# Altium project Snap21.PrjPCB
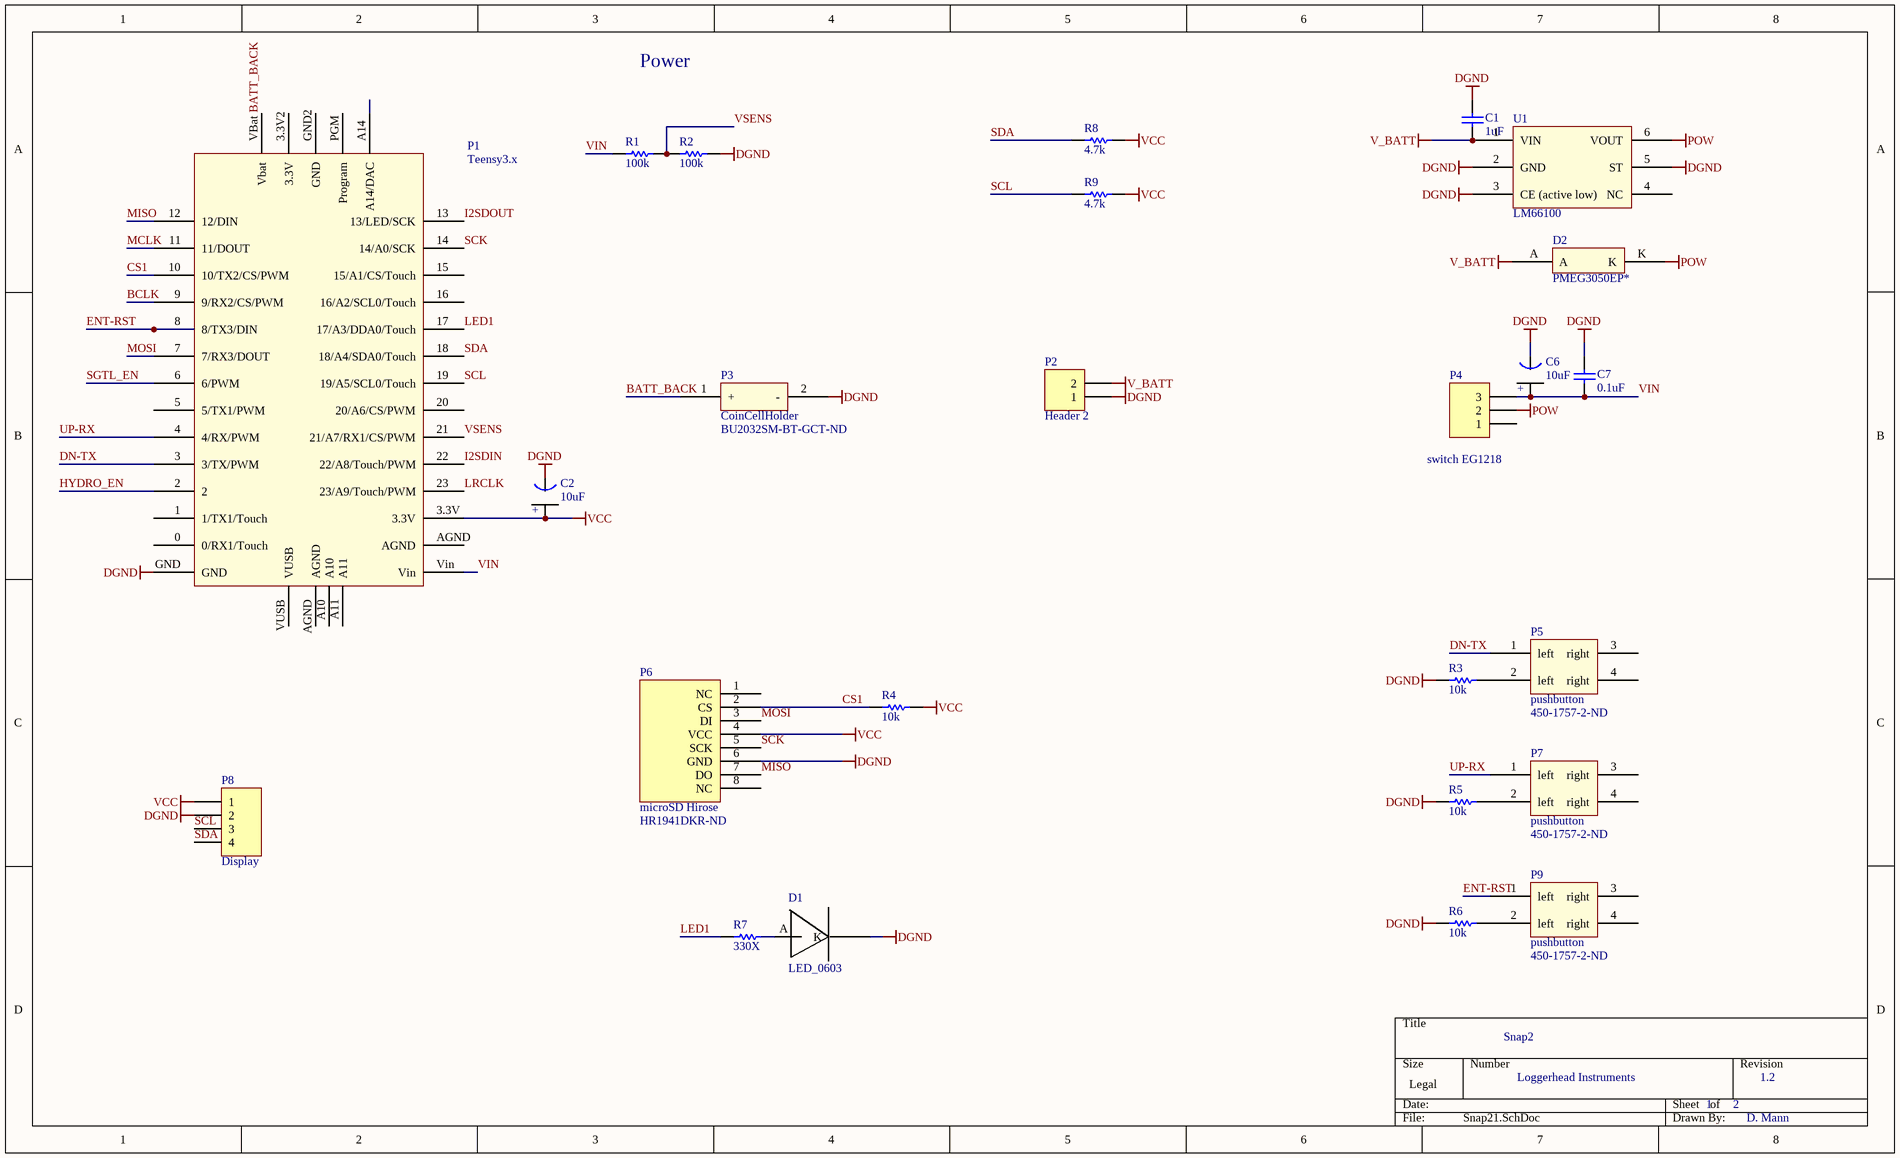
[diagram p0: Snap21.SchDoc]
1 sheet, 25 parts. Net scope: global (net labels, ports and power ports of the same name join across sheets).
Board file: Snap21.PcbDoc

## Sheet Snap21.SchDoc
size Legal

### Parts
C1  1uF  [0402]
C2  10uF  [Tant0805]
C6  10uF  [Tant0805]
C7  0.1uF  [0402]
D1  LED_0603  [Diode0603]
D2  PMEG3050EP*  [Diode_PMEG3050EP]
P1  Teensy3.x  [Teensy3.x]
P2  Header 2  [HDR1X2]
P3  CoinCellHolder  Supplier Part Number 1: BU2032SM-BT-GCT-ND  [CoinCellHolder]
P4  switch EG1218  [HDR1X3]
P5  pushbutton  Supplier Part Number 1: 450-1757-2-ND  [SOP4]
P6  microSD Hirose  Supplier Part Number 1: HR1941DKR-ND  [DM3D microSD]
P7  pushbutton  Supplier Part Number 1: 450-1757-2-ND  [SOP4]
P8  Display  [HDR1X4]
P9  pushbutton  Supplier Part Number 1: 450-1757-2-ND  [SOP4]
R1  100k  [3-0603]
R2  100k  [3-0603]
R3  10k  [3-0603]
R4  10k  [3-0603]
R5  10k  [3-0603]
R6  10k  [3-0603]
R7  330X  [3-0603]
R8  4.7k  [3-0603]
R9  4.7k  [3-0603]
U1  LM66100  [SC-70-6]

### Nets
DGND: C1.1 C2.1(GND) C6.1(GND) C7.2 D1.K P1.GND P2.1 P3.2(-) P6.6(GND) P8.2 R2.1 R3.2 R5.2 R6.2 U1.2(GND) U1.3(CE_(active_low)) U1.5(ST)
POW: D2.K P4.2 U1.6(VOUT)
V_BATT: C1.2 D2.A P2.2 U1.1(VIN)
VCC: C2.2(+) P1.3.3V P6.4(VCC) P8.1 R4.1 R8.2 R9.2
BATT_BACK: P1.VBat(Vbat) P3.1(+)
BCLK: P1.9(9/RX2/CS/PWM)
CS1: P1.10(10/TX2/CS/PWM) P6.2(CS) R4.2
DN-TX: P1.3(3/TX/PWM) P5.1(left)
ENT-RST: P1.8(8/TX3/DIN) P9.1(left)
HYDRO_EN: P1.2
I2SDIN: P1.22(22/A8/Touch/PWM)
I2SDOUT: P1.13(13/LED/SCK)
LED1: P1.17(17/A3/DDA0/Touch) R7.1
LRCLK: P1.23(23/A9/Touch/PWM)
MCLK: P1.11(11/DOUT)
MISO: P1.12(12/DIN) P6.7(DO)
MOSI: P1.7(7/RX3/DOUT) P6.3(DI)
SCK: P1.14(14/A0/SCK) P6.5(SCK)
SCL: P1.19(19/A5/SCL0/Touch) P8.3 R9.1
SDA: P1.18(18/A4/SDA0/Touch) P8.4 R8.1
SGTL_EN: P1.6(6/PWM)
UP-RX: P1.4(4/RX/PWM) P7.1(left)
VIN: C6.2(+) C7.1 P1.Vin P4.3 R1.2
VSENS: P1.21(21/A7/RX1/CS/PWM) R1.1 R2.2
NetD1_A: D1.A R7.2
NetP5_2: P5.2(left) R3.1
NetP7_2: P7.2(left) R5.1
NetP9_2: P9.2(left) R6.1

Not connected (* = marked no-connect by the designer): P1 0(0/RX1/Touch) 1(1/TX1/Touch) 3.3V2(3.3V) 5(5/TX1/PWM) 15(15/A1/CS/Touch) 16(16/A2/SCL0/Touch) 20(20/A6/CS/PWM) A10 A11 A14(A14/DAC) AGND GND2(GND) PGM(Program) VUSB; P4 1; P5 3(right) 4(right); P6 1(NC) 8(NC); P7 3(right) 4(right); P9 3(right) 4(right); U1 4(NC)

### Notes on the sheet
- Power
- Snap2
- Loggerhead Instruments
- 1
- 2
- 1.2
- D. Mann

### Library data of the parts
C1 = C0402: Ceramic Chip Capacitor - Standard; Note: Footprint corresponds to dimensions for bulk cassette packaging. This case size has tightened tolerances.; Value: 0.1uF; Published: 17-Jul-2002; LatestRevisionDate: 19-Mar-2004; LatestRevisionNote: Silkscreen size reduced.; DatasheetDocument: Mar-2001; PackageDocument: Mar-2001; PackageReference: 0402; Publisher: Altium Limited; Code_JEITA: 0402; Code_IPC: 1005 [0402]; ComponentLink1Description: Manufacturer Link; ComponentLink1URL: http://www.kemet.com/; ComponentLink2Description: Datasheet; ComponentLink2URL: http://www.kemet.com/kemet/web/homepage/kechome.nsf/vapubfilesname/F3102TA.pdf/$file/F3102TA.pdf
C2 C6 = Tant0805: Value: 10uF
C7 = C0402: Ceramic Chip Capacitor - Standard; Note: Footprint corresponds to dimensions for bulk cassette packaging. This case size has tightened tolerances.; Published: 17-Jul-2002; LatestRevisionDate: 19-Mar-2004; LatestRevisionNote: Silkscreen size reduced.; DatasheetDocument: Mar-2001; PackageDocument: Mar-2001; PackageReference: 0402; Publisher: Altium Limited; Code_JEITA: 0402; Code_IPC: 1005 [0402]; ComponentLink1Description: Manufacturer Link; ComponentLink1URL: http://www.kemet.com/; ComponentLink2Description: Datasheet; ComponentLink2URL: http://www.kemet.com/kemet/web/homepage/kechome.nsf/vapubfilesname/F3102TA.pdf/$file/F3102TA.pdf; Value: 0.1uF
D2 = Diode_PMEG3050EP
P2 = Header 2: Header, 2-Pin; LatestRevisionDate: 17-Jul-2002; LatestRevisionNote: Re-released for DXP Platform.; Publisher: Altium Limited
P4 = Header 3: Header, 3-Pin; LatestRevisionDate: 17-Jul-2002; LatestRevisionNote: Re-released for DXP Platform.; Publisher: Altium Limited
P8 = Header 4: Header, 4-Pin; LatestRevisionDate: 17-Jul-2002; LatestRevisionNote: Re-released for DXP Platform.; Publisher: Altium Limited
R1-R9 = ERJ3RK: Precision Thick Film Chip Resistor, 10 Ohm to 1M Ohm Range, 1% and 0.5% Tolerance, 0603 Size, 0.063 W; Published: 17-Dec-2003; LatestRevisionDate: 19-Mar-2004; LatestRevisionNote: Silkscreen size reduced.; PackageDocument: Mar-2003; PackageReference: 3-0603; Publisher: Altium Limited; Code_IPC: 1608 [0603]; ComponentLink1Description: Manufacturer Link; ComponentLink1URL: http://www.panasonic.com/industrial/components/resistive_products.htm; ComponentLink2Description: Datasheet; ComponentLink2URL: http://www.panasonic.com/industrial/components/pdf/AOA0000CE2.pdf
P3 = CoinCellHolder: Supplier 1: Digi-Key
P5 P7 P9 = pushbutton: Supplier 1: Digi-Key
P6 = microSD Hirose: Supplier 1: Digi-Key